# EAGLE design Dev21 (EAGLE 9.1.3)
PROJECT: This Project
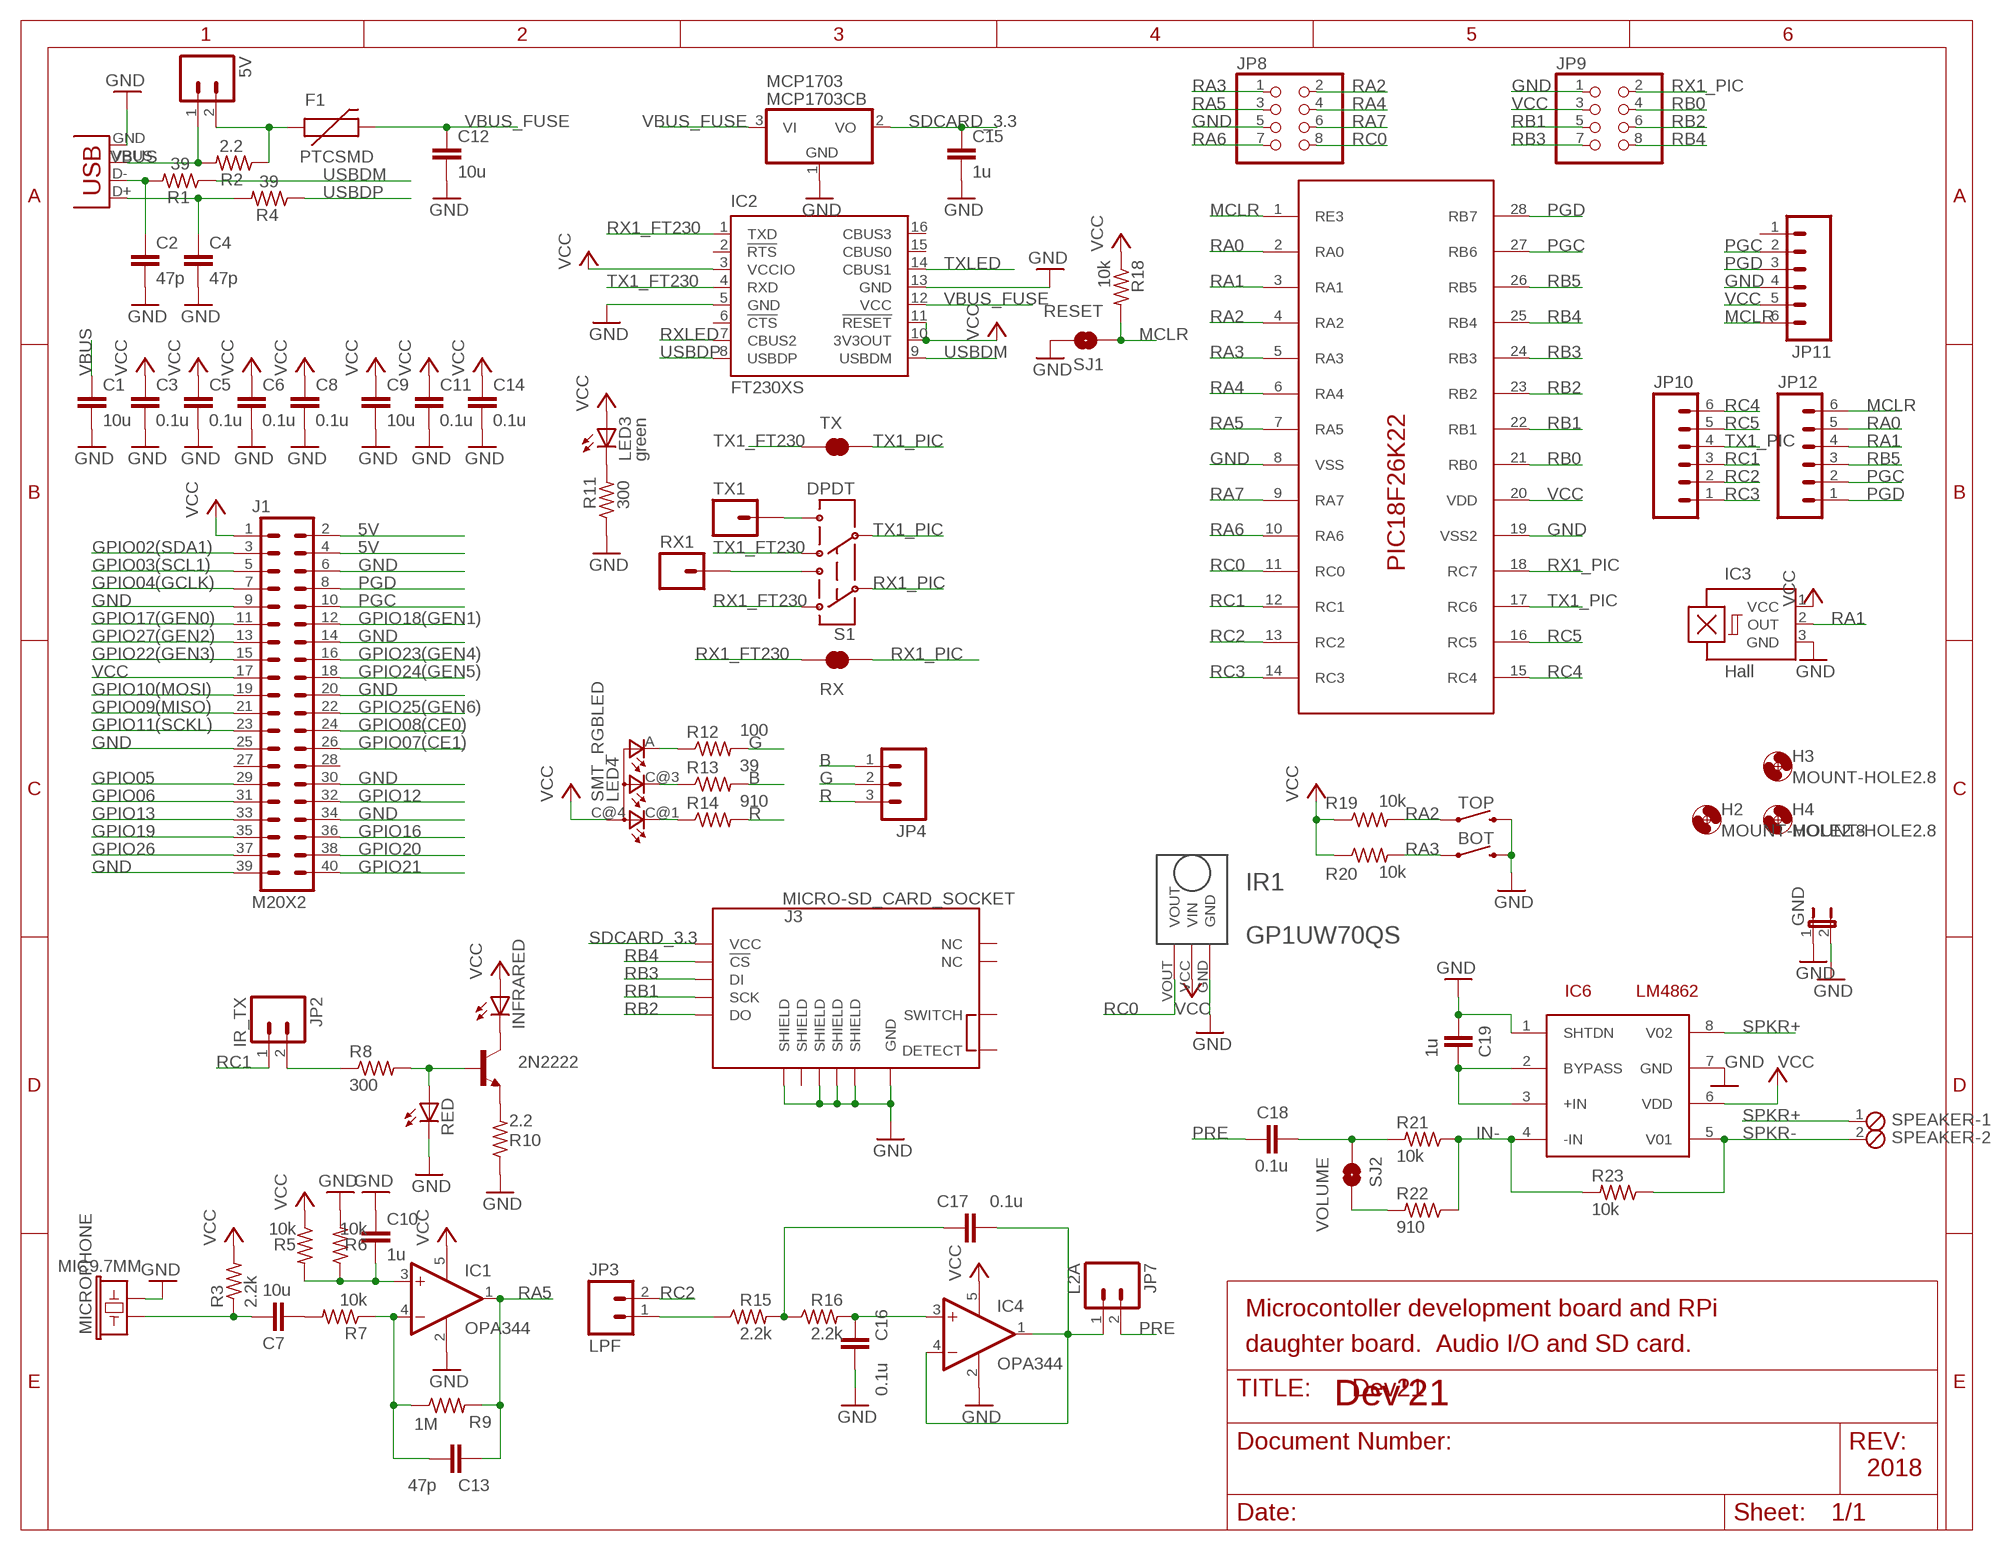
[diagram p0: schematic, sheet 1]

## Parts
2N2222  TRANSISTOR_NPNSOT23-3  [SOT23-3]
5V  M02LOCK  [1X02_LOCK]
BOT  MOMENTARY-SWITCH-SPST-SMD-5.2MM  [TACTILE_SWITCH_SMD_5.2MM]
C1  10u  C-EUC1206  [C1206]
C2  47p  C-EUC1206  [C1206]
C3  0.1u  C-EUC1206  [C1206]
C4  47p  C-EUC1206  [C1206]
C5  0.1u  C-EUC1206  [C1206]
C6  0.1u  C-EUC1206  [C1206]
C7  10u  C-EUC1206  [C1206]
C8  0.1u  C-EUC1206  [C1206]
C9  10u  C-EUC1206  [C1206]
C10  1u  C-EUC1206  [C1206]
C11  0.1u  C-EUC1206  [C1206]
C12  10u  C-EUC1206  [C1206]
C13  47p  C-EUC1206  [C1206]
C14  0.1u  C-EUC1206  [C1206]
C15  1u  C-EUC1206  [C1206]
C16  0.1u  C-EUC1206  [C1206]
C17  0.1u  C-EUC1206  [C1206]
C18  0.1u  C-EUC1206  [C1206]
C19  1u  C-EUC1206  [C1206]
F1  PTCSMD  [PTC-1206]
GND  JP1E  [JP1]
H2  MOUNT-HOLE2.8  [2,8]
H3  MOUNT-HOLE2.8  [2,8]
H4  MOUNT-HOLE2.8  [2,8]
IC1  OPA344  OPA344N-SOT23  [SOT23-5]
IC2  FT230XS  [SSOP16]
IC3  Hall  A1202LH  [SOT23-W]
IC4  OPA344  OPA344N-SOT23  [SOT23-5]
IC6  LM4862  [SO08]
INFRARED  LED1206  [LED-1206]
IR1  GP1UW70QS  [GP1UW70QS]
J1  M20X2  [2X20]
J3  MICRO-SD_CARD_SOCKET  [MICRO-SD-SOCKET]
JP2  IR_TX  M02LOCK  [1X02_LOCK]
JP3  LPF  M02LOCK  [1X02_LOCK]
JP4  M03LOCK  [1X03_LOCK]
JP7  L2A  M02LOCK  [1X02_LOCK]
JP8  PINHD-2X4  [2X04]
JP9  PINHD-2X4  [2X04]
JP10  M06LOCK  [1X06_LOCK]
JP11  M06LOCK  [1X06_LOCK]
JP12  M06LOCK  [1X06_LOCK]
LED3  green  LED1206  [LED-1206]
LED4  SMT_RGBLED  [P-LCC-4]
MCP1703  MCP1703CB  [SOT23]
MICROPHONE  MIC9.7MM  [MIC-9.7MM]
PIC18F26K22  PIC18F26J2228SSOP  [SSOP28DB]
R1  39  R-US_R1206  [R1206]
R2  2.2  R-US_R1206  [R1206]
R3  2.2k  R-US_R1206  [R1206]
R4  39  R-US_R1206  [R1206]
R5  10k  R-US_R1206  [R1206]
R6  10k  R-US_R1206  [R1206]
R7  10k  R-US_R1206  [R1206]
R8  300  R-US_R1206  [R1206]
R9  1M  R-US_R1206  [R1206]
R10  2.2  R-US_R1206  [R1206]
R11  300  R-US_R1206  [R1206]
R12  100  R-US_R1206  [R1206]
R13  39  R-US_R1206  [R1206]
R14  910  R-US_R1206  [R1206]
R15  2.2k  R-US_R1206  [R1206]
R16  2.2k  R-US_R1206  [R1206]
R18  10k  R-US_R1206  [R1206]
R19  10k  R-US_R1206  [R1206]
R20  10k  R-US_R1206  [R1206]
R21  10k  R-US_R1206  [R1206]
R22  910  R-US_R1206  [R1206]
R23  10k  R-US_R1206  [R1206]
RED  LED1206  [LED-1206]
RX  SJ_NC  JUMPER-SMT_2_NC_TRACE_NO-SILK  [SMT-JUMPER_2_NC_TRACE_NO-SILK]
RX1  M01PTH  [1X01]
S1  DPDT  SWITCH-DPDTAYZ0202  [AYZ0202]
SJ1  RESET  SOLDERJUMPERNC2  [SJ_2S-NOTRACE]
SJ2  VOLUME  SOLDERJUMPERNC2  [SJ_2S-NOTRACE]
SPEAKER  MPT2  [2POL254]
TOP  MOMENTARY-SWITCH-SPST-SMD-5.2MM  [TACTILE_SWITCH_SMD_5.2MM]
TX  SJ_NC  JUMPER-SMT_2_NC_TRACE_NO-SILK  [SMT-JUMPER_2_NC_TRACE_NO-SILK]
TX1  M01PTH  [1X01]
X1  USBSMD  [USB-MINIB]

## Nets
5V: J1.2 J1.4
B: JP4.1 R13.2
G: JP4.2 R12.2
GND: BOT.3 C1.2 C2.2 C3.2 C4.2 C5.2 C6.2 C8.2 C9.2 C10.1 C11.2 C12.2 C14.2 C15.2 C16.1 C19.2 GND.1 GND.2 IC1.2(V-) IC2.5(GND) IC2.13(GND) IC3.3(GND) IC4.2(V-) IC6.1(SHTDN) IC6.7(GND) IR1.GND J1.6 J1.9 J1.14 J1.20 J1.25 J1.30 J1.34 J1.39 J3.GND J3.SHIELD1(SHIELD) J3.SHIELD3(SHIELD) J3.SHIELD4(SHIELD) J3.SHIELD5(SHIELD) JP8.5 JP9.1 JP11.4 MCP1703.1(GND) MICROPHONE.2 PIC18F26K22.8(VSS) PIC18F26K22.19(VSS2) R6.2 R10.1 R11.1 RED.C SJ1.2 TOP.3 X1.GND
GPIO02(SDA1): J1.3
GPIO03(SCL1): J1.5
GPIO04(GCLK): J1.7
GPIO05: J1.29
GPIO06: J1.31
GPIO07(CE1): J1.26
GPIO08(CE0): J1.24
GPIO09(MISO): J1.21
GPIO10(MOSI): J1.19
GPIO11(SCKL): J1.23
GPIO12: J1.32
GPIO13: J1.33
GPIO16: J1.36
GPIO17(GEN0): J1.11
GPIO18(GEN1): J1.12
GPIO19: J1.35
GPIO20: J1.38
GPIO21: J1.40
GPIO22(GEN3): J1.15
GPIO23(GEN4): J1.16
GPIO24(GEN5): J1.18
GPIO25(GEN6): J1.22
GPIO26: J1.37
GPIO27(GEN2): J1.13
IN-: IC6.4(-IN) R21.1 R22.1 R23.2
MCLR: JP11.6 JP12.6 PIC18F26K22.1(RE3) R18.2 SJ1.1
MIC: C13.1 IC1.4(-IN) R7.1 R9.1
N$1: C16.2 IC4.3(+IN) R16.2
N$2: C17.2 R15.2 R16.1
N$3: C17.1 IC4.1(OUT) IC4.4(-IN) JP7.1
N$4: JP3.1 R15.1
N$6: C2.1 R1.2 X1.D-
N$7: C4.1 R4.2 X1.D+
N$8: C7.1 MICROPHONE.1 R3.1
N$9: C7.2 R7.2
N$10: 5V.2 F1.1 R2.1
N$11: C10.2 IC1.3(+IN) R5.2 R6.1
N$12: RX1.1 S1.3
N$13: LED4.C@1(CRED) R14.1
N$14: LED4.A(CGREEN) R12.1
N$15: 2N2222.3(C) INFRARED.C
N$16: LED3.C R11.2
N$17: 2N2222.2(E) R10.2
N$18: LED4.C@3(CBLUE) R13.1
N$19: 2N2222.1(B) R8.2 RED.A
N$20: C19.1 IC6.2(BYPASS) IC6.3(+IN)
N$22: JP2.2 R8.1
N$23: S1.6 TX1.1
N$27: C18.1 R21.2 SJ2.1
N$28: R22.2 SJ2.2
PGC: J1.10 JP11.2 JP12.2 PIC18F26K22.27(RB6)
PGD: J1.8 JP11.3 JP12.1 PIC18F26K22.28(RB7)
PRE: C18.2 JP7.2
R: JP4.3 R14.2
RA0: JP12.5 PIC18F26K22.2(RA0)
RA1: IC3.2(OUT) JP12.4 PIC18F26K22.3(RA1)
RA2: JP8.2 PIC18F26K22.4(RA2) R19.2 TOP.1
RA3: BOT.1 JP8.1 PIC18F26K22.5(RA3) R20.2
RA4: JP8.4 PIC18F26K22.6(RA4)
RA5: C13.2 IC1.1(OUT) JP8.3 PIC18F26K22.7(RA5) R9.2
RA6: JP8.7 PIC18F26K22.10(RA6)
RA7: JP8.6 PIC18F26K22.9(RA7)
RB0: JP9.4 PIC18F26K22.21(RB0)
RB1: J3.SCLK(SCK) JP9.5 PIC18F26K22.22(RB1)
RB2: J3.DO JP9.6 PIC18F26K22.23(RB2)
RB3: J3.DI JP9.7 PIC18F26K22.24(RB3)
RB4: J3.CS(!CS) JP9.8 PIC18F26K22.25(RB4)
RB5: JP12.3 PIC18F26K22.26(RB5)
RC0: IR1.VOUT JP8.8 PIC18F26K22.11(RC0)
RC1: JP2.1 JP10.3 PIC18F26K22.12(RC1)
RC2: JP3.2 JP10.2 PIC18F26K22.13(RC2)
RC3: JP10.1 PIC18F26K22.14(RC3)
RC4: JP10.6 PIC18F26K22.15(RC4)
RC5: JP10.5 PIC18F26K22.16(RC5)
RX1_FT230: IC2.1(TXD) RX.1 S1.1
RX1_PIC: JP9.2 PIC18F26K22.18(RC7) RX.2 S1.2
RXLED: IC2.7(CBUS2)
SDCARD_3.3: C15.1 J3.VCC MCP1703.2(VO)
SPKR+: IC6.8(V02) SPEAKER.1
SPKR-: IC6.5(V01) R23.1 SPEAKER.2
TX1_FT230: IC2.4(RXD) S1.4 TX.1
TX1_PIC: JP10.4 PIC18F26K22.17(RC6) S1.5 TX.2
TXLED: IC2.14(CBUS1)
USBDM: IC2.9(USBDM) R1.1
USBDP: IC2.8(USBDP) R4.1
VBUS: 5V.1 C1.1 R2.2 X1.VBUS
VBUS_FUSE: C12.1 F1.2 IC2.12(VCC) MCP1703.3(VI)
VCC: C3.1 C5.1 C6.1 C8.1 C9.1 C11.1 C14.1 IC1.5(V+) IC2.3(VCCIO) IC2.10(3V3OUT) IC2.11(!RESET) IC3.1(VCC) IC4.5(V+) IC6.6(VDD) INFRARED.A IR1.VCC(VIN) J1.1 J1.17 JP9.3 JP11.5 LED3.A LED4.C@4(A) PIC18F26K22.20(VDD) R3.2 R5.1 R18.1 R19.1 R20.1
Unconnected: IC2.2(!RTS) IC2.6(!CTS) IC2.15(CBUS0) IC2.16(CBUS3) J1.27 J1.28 J3.DETECT J3.NC1(NC) J3.NC2(NC) J3.SHIELD2(SHIELD) J3.SWITCH JP11.1

## Notes on the sheet
- Microcontoller development board and RPi
- daughter board.  Audio I/O and SD card.
- Dev'21
- 2018

## Library data of the parts
2N2222 = SparkFun-DiscreteSemi:TRANSISTOR_NPN: Generic NPN BJT MMBT2222A - TRANS-08049 (SOT-23, 1A 40V) MPSA42 - TRANS-09116 (SOT-23, 500mA 300V) MMBT5088LT1G - TRANS-11160 (SOT-23, 50 mA 30V) BC547 - COM-08928 <http://www.sparkfun.com/products/8928> (TO-92 45V 100mA) (1.Collector 2.Base 3.Emitter) 2N3904 - COM-00521 <http://www.sparkfun.com/products/521> (TO-92 40V 200mA) (1.Emitter 2.Base 3.Collector) P2N2222A - COM-12852 <http://www.sparkfun.com/products/12852> (TO-92 40V 600mA) (1.Collector 2.Base 3.Emitter); PROD_ID: TRANS-08049
5V JP2 JP3 JP7 = SparkFun:M02: Header 2 Standard 2-pin 0.1" header. Use with straight break away headers (SKU : PRT-00116), right angle break away headers (PRT-00553), swiss pins (PRT-00743), machine pins (PRT-00117), and female headers (PRT-00115). Molex polarized connector foot print use with SKU : PRT-08233 with associated crimp pins and housings.
BOT TOP = SparkFun-Switches:MOMENTARY-SWITCH-SPST: Momentary Switch (Pushbutton) - SPST Normally-open (NO) SPST momentary switches (buttons, pushbuttons). Variants PTH-12MM - 12mm square, through-hole Momentary Pushbutton Switch - 12mm Square <https://www.sparkfun.com/products/9190> (COM-09190) PTH-6.0MM, PTH-6.0MM-KIT - 6.0mm square, through-hole Mini Pushbutton Switch <https://www.sparkfun.com/products/97> (COM-00097) KIT package intended for soldering kit's - only one side of pads' copper is exposed. PTH-RIGHT-ANGLE-KIT - Right-angle, through-hole Right Angle Tactile Button <https://www.sparkfun.com/products/10791> - Used on SparkFun BigTime Watch Kit <https://www.sparkfun.com/products/11734> SMD-12MM - 12mm square, surface-mount Tactile Button - SMD (12mm) <https://www.sparkfun.com/products/12993> (COM-12993) Used on SparkFun PicoBoard <https://www.sparkfun.com/products/11888> SMD-4.5MM - 4.5mm Square Trackball Switch Used on SparkFun Blackberry Trackballer Breakout <https://www.sparkfun.com/products/13169> SMD-4.6MMX2.8MM - 4.60mm x 2.80mm, surface mount Used on SparkFun SAMD21 Mini Breakout <https://www.sparkfun.com/products/13664> SMD-5.2MM, SMD-5.2-REDUNDANT - 5.2mm square, surface-mount Mini Pushbutton Switch - SMD <https://www.sparkfun.com/products/8720> (COM-08720) Used on Arduino Pro Mini <https://www.sparkfun.com/products/11114> REDUNDANT package connects both switch circuits together SMD-6.0X3.5MM - 6.0 x 3.5mm, surface mount Momentary Reset Switch SMD <https://www.sparkfun.com/products/8229> (COM-08229) SMD-6.2MM-TALL - 6.2mm square, surface mount Tactile Button - SMD (6mm) <https://www.sparkfun.com/products/12992> Used on SparkFun Digital Sandbox <https://www.sparkfun.com/products/12651> SMD-RIGHT-ANGLE - Right-angle, surface mount Used on SparkFun Block for Intel® Edison - Arduino <https://www.sparkfun.com/products/13036>; PROD_ID: SWCH-08247; SF_SKU: COM-08720
C1-C19 = rcl:C-EU: CAPACITOR, European symbol
F1 = SparkFun:PTC: Resettable Fuse PTC Resettable Fuse. Spark Fun Electronics SKU : COM-08357
GND = jumper:JP1E: JUMPER
H2-H4 = holes:MOUNT-HOLE: MOUNTING HOLE with drill center marker
IC1 IC4 = linear:OPA*-SOT23: Single Operational Amplifier Low Power, Single-Supply, Rail-To-Rail Operational Amplifier Source: http://focus.ti.com/lit/ds/symlink/opa2345.pdf
IC2 = ftdichip:FT230X: USB to BASIC UART IC Auto generated by make-symbol-device-package-bsdl.ulp Rev. 43 Source: Data sheet <http://www.ftdichip.com/Support/Documents/DataSheets/ICs/DS_FT230X.pdf>
IC3 = allegro:A12*?: Hall-effect bipolar switch Source: http://www.allegromicro.com/en/Products/Part_Numbers/1202/1202.pdf; OC_FARNELL: unknown; OC_NEWARK: unknown
IC6 = coulston:LM4862
INFRARED LED3 RED = SparkFun:LED: LEDs Standard schematic elements and footprints for 5mm, 3mm, 1206, and 0603 sized LEDs. 5mm - Spark Fun Electronics SKU : COM-00529 (and others)
IR1 = coulston:GP1UW70QS
J1 = SparkFun-Connectors:M20X2: 0.1" spaced headers
J3 = coulston:MICRO-SD_CARD_SOCKET: microSD Socket for Transflash Push-push type µSD socket. tDoc line correctly indicate media card edge positions when locked. NOTE:Switch and Detect are N.O. SD card presence indicator.; DIGIKEY: WM12834CT-ND
JP4 = SparkFun:M03: Header 3 Standard 3-pin 0.1" header. Use with straight break away headers (SKU : PRT-00116), right angle break away headers (PRT-00553), swiss pins (PRT-00743), machine pins (PRT-00117), and female headers (PRT-00115). Molex polarized connector foot print use with SKU : PRT-08232 with associated crimp pins and housings.
JP8 JP9 = pinhead:PINHD-2X4: PIN HEADER
JP10-JP12 = SparkFun:M06: Header 6 Standard 6-pin 0.1" header. Use with straight break away headers (SKU : PRT-00116), right angle break away headers (PRT-00553), swiss pins (PRT-00743), machine pins (PRT-00117), and female headers (PRT-00115). Molex polarized connector foot print use with SKU : PRT-08094 with associated crimp pins and housings. NOTES ON THE VARIANTS LOCK and LOCK_LONGPADS... This footprint was designed to help hold the alignment of a through-hole component (i.e. 6-pin header) while soldering it into place. You may notice that each hole has been shifted either up or down by 0.005 of an inch from it's more standard position (which is a perfectly straight line). This slight alteration caused the pins (the squares in the middle) to touch the edges of the holes. Because they are alternating, it causes a "brace" to hold the component in place. 0.005 has proven to be the perfect amount of "off-center" position when using our standard breakaway headers. Although looks a little odd when you look at the bare footprint, once you have a header in there, the alteration is very hard to notice. Also, if you push a header all the way into place, it is covered up entirely on the bottom side. This idea of altering the position of holes to aid alignment will be further integrated into the Sparkfun Library for other footprints. It can help hold any component with 3 or more connection pins.
LED4 = coulston:SMT_RGBLED: Chip LED RGB Source: http://document.sharpsma.com/files/GM1WA55311A_SS.pdf
MCP1703 = linear:MCP1703: 250 mA, 16V, Low Quiescent Current LDO Regulator Source: http://ww1.microchip.com/downloads/en/DeviceDoc/22049b.pdf
MICROPHONE = SparkFun-Sensors:MIC: Omni-directional electret microphone. 9.7mm standard diameter.; PROD_ID: COMP-08856
PIC18F26K22 = coulston:PIC18F26J22
R1-R16 R18-R23 = rcl:R-US_: RESISTOR, American symbol
RX TX = SparkFun-Jumpers:JUMPER-SMT_2_NC_TRACE: Normally closed trace jumper This jumper has a trace between two pads so it's normally closed (NC). Use a razor knife to open the connection. For best results follow the IPC guidelines for cutting traces: Cutout at least 0.063 mm (0.005 in). Remove all loose material to clean up the cut area. Seal the cut with an approved epoxy. Reapply solder to reclose the connection.
RX1 TX1 = SparkFun-Connectors:M01: Header 1 Standard 1-pin 0.1" header. Use with straight break away headers (SKU : PRT-00116), right angle break away headers (PRT-00553), swiss pins (PRT-00743), machine pins (PRT-00117), and female headers (PRT-00115). SMTSO-256-ET is a "flush mount" nut for a 4-40 screw. The older package used to be too tight, and did not allow it to sit properly thru the drill hit. The latest (0.165DIA) fits nice and snug.
S1 = SparkFun-Electromechanical:SWITCH-DPDT: DPDT Version of the COM-00597; PROD_ID: SWCH-08179
SJ1 SJ2 = SparkFun:SOLDERJUMPER: Solder Jumper Standard SMD solder jumper. Used to automate production. Two varients : Normally Open and Normally Closed are the same, but have different paste layers. NC will have a large amount of paste and should jumper during reflow.
SPEAKER = dodecahedron:MPT2: PHOENIX CONNECTOR
X1 = SparkFun:USB: USB Connectors USB-B-PTH is fully proven SKU : PRT-00139 USB-miniB is fully proven SKU : PRT-00587 USB-A-PCB is untested. USB-A-H is throughly reviewed, but untested. Spark Fun Electronics SKU : PRT-00437 USB-B-SMT is throughly reviewed, but untested. Needs silkscreen touching up. USB-A-S has not been used/tested USB-MB-H has not been used/tested

## Board
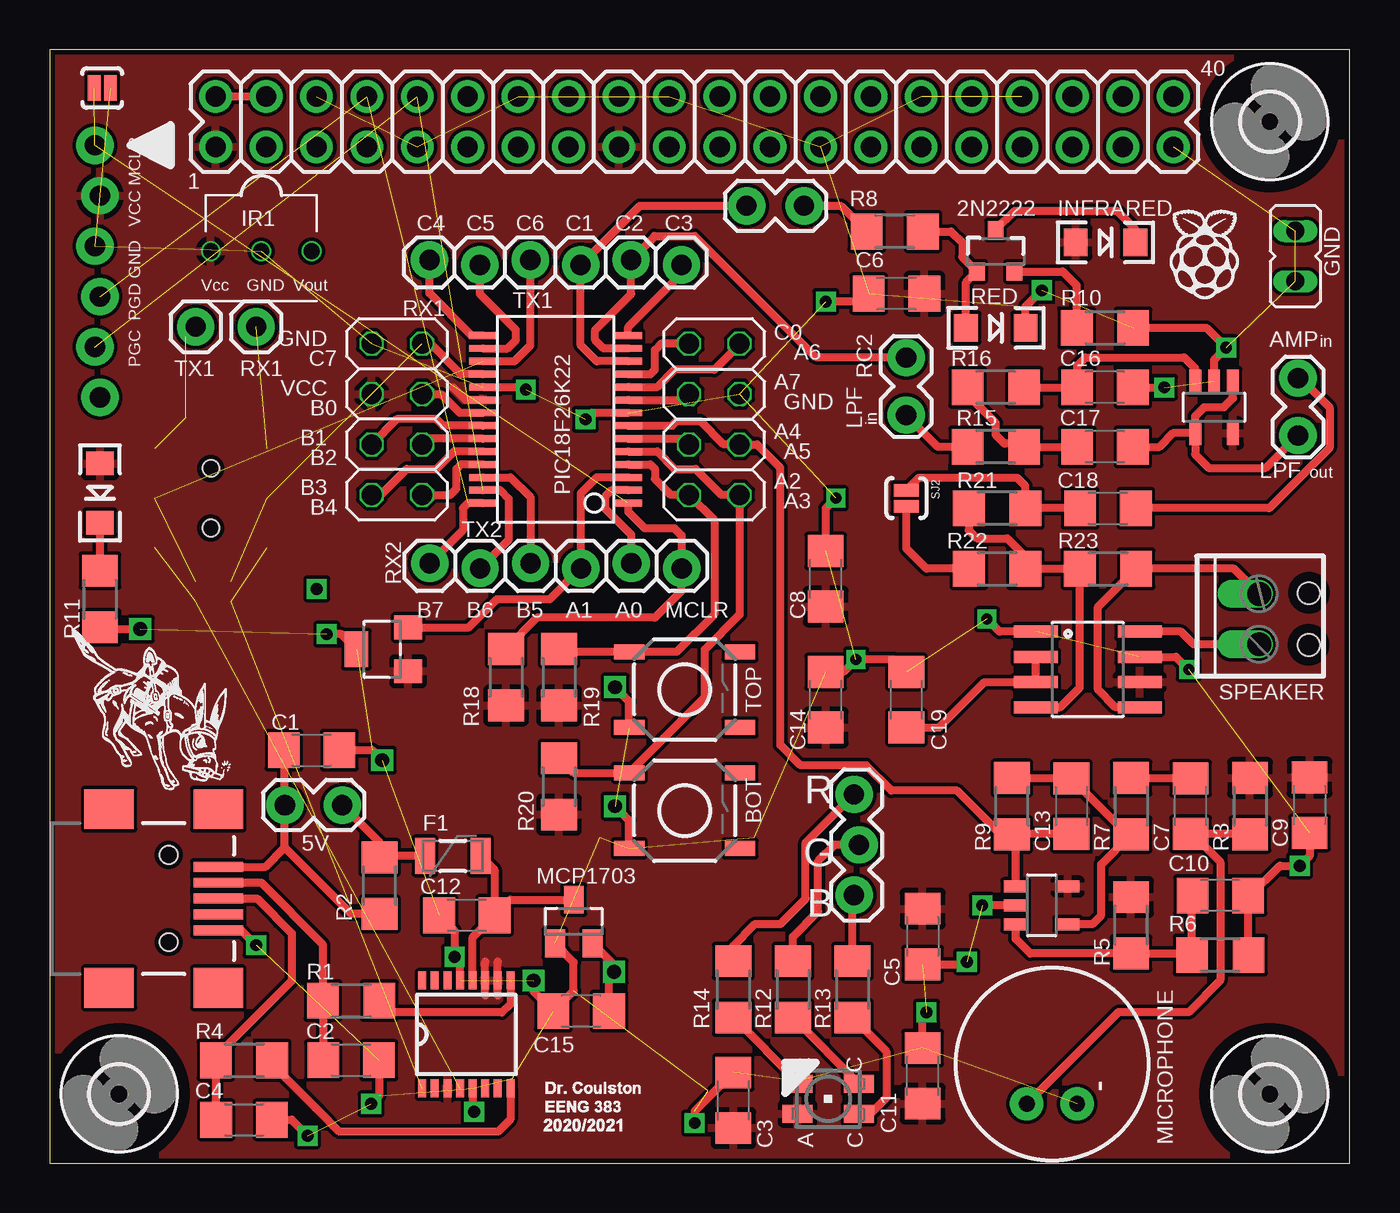
[diagram p1: board, top side]
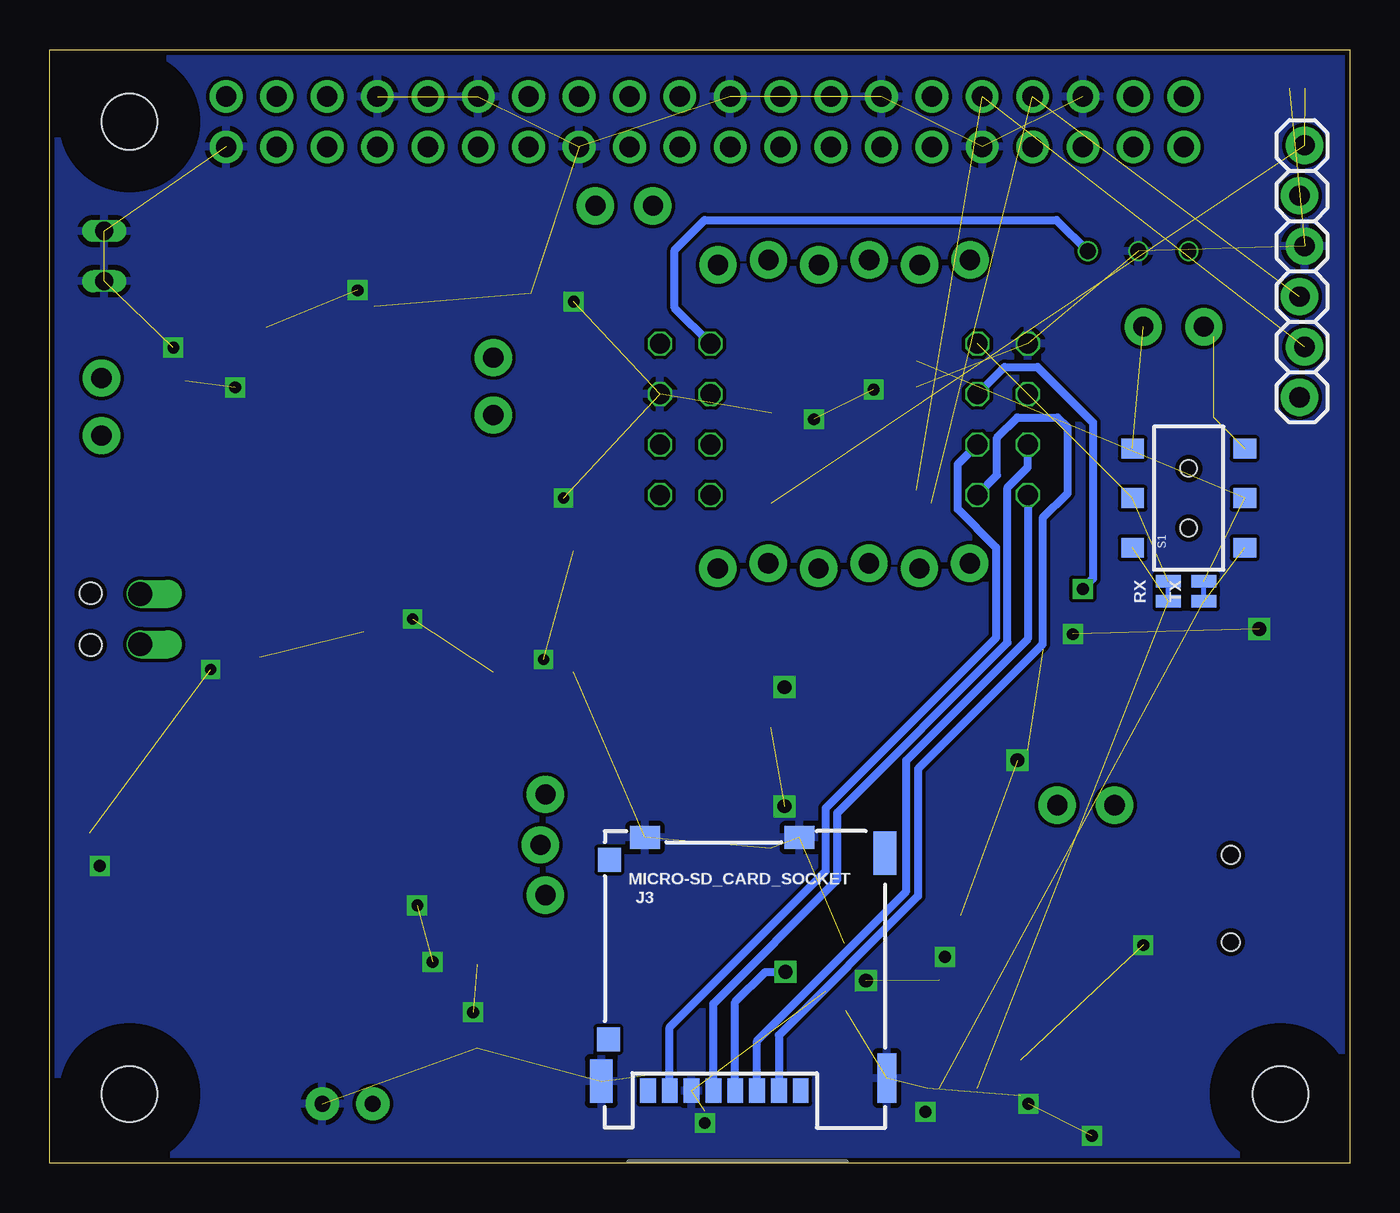
[diagram p2: board, bottom side, seen from below]

Size 65.53 x 56.13 mm. Coordinates in mm from the lower left corner, seen from the top.
Outline: 0,0 65.53,0 65.53,56.13 0,56.13 0,0
Copper layers (1*16): Top 0.0356mm / dielectric 1.5011mm / Bottom 0.0356mm
Design rules "SilverCircuits": minimum track width 7mil, minimum drill 10mil, track to track 7mil, track to pad 7mil, pad to pad 7mil, via to via 7mil, smd to smd 0mil, copper to edge 10mil, drill to drill 10mil, minimum pad ring 4mil, minimum via ring 8mil, stop-mask expansion 4mil, vias tented up to drill 0mil, thermal gap 10mil

### Footprints (pad centres in the part's own frame; a part is rotated, then mirrored left to right if it is on the bottom)
SOT23-3 = smd 0.8 x 0.9: 1 -0.95,-1; 2 0.95,-1; 3 0,1.1
1X02_LOCK = drill 1.016 pad 1.88: 1 -0.178,0; 2 2.718,0
TACTILE_SWITCH_SMD_5.2MM = smd 1.524 x 0.762: 1 -2.794,1.905; 2 2.794,1.905; 3 -2.794,-1.905; 4 2.794,-1.905
C1206 = smd 1.6 x 1.8: 1 -1.4,0; 2 1.4,0
PTC-1206 = smd 1 x 1.8: 1 -1.4,0; 2 1.4,0
JP1 = drill 0.914 long: 1 0,-1.27; 2 0,1.27
2,8 = hole 2.8: 0,0
SOT23-5 = smd 0.6 x 1.2: 1 -0.95,-1.306; 2 0,-1.306; 3 0.95,-1.306; 4 0.95,1.306; 5 -0.95,1.306
SSOP16 = smd 0.914 x 0.406: 1 -2.718,2.223; 2 -2.718,1.587; 3 -2.718,0.953; 4 -2.718,0.318; 5 -2.718,-0.318; 6 -2.718,-0.953; 7 -2.718,-1.587; 8 -2.718,-2.223; 9 2.718,-2.223; 10 2.718,-1.587; 11 2.718,-0.953; 12 2.718,-0.318; 13 2.718,0.318; 14 2.718,0.953; 15 2.718,1.587; 16 2.718,2.223
SOT23-W = smd 1.2 x 1.4: 1 -1.1,-1.3; 2 1.1,-1.3 | smd 1.8 x 1.2: 3 0,1.3
SO08 = smd 0.61 x 2.21: 1 -1.905,-2.616; 2 -0.635,-2.616; 3 0.635,-2.616; 4 1.905,-2.616; 5 1.905,2.616; 6 0.635,2.616; 7 -0.635,2.616; 8 -1.905,2.616
LED-1206 = smd 1.2 x 1.4: A -1.5,0; C 1.5,0
GP1UW70QS = drill 0.8: GND 0,2.54; VCC -2.54,2.54; VOUT 2.54,2.54
2X20 = drill 1.016 pad 1.651: 1 -24.13,-1.27; 2 -24.13,1.27; 3 -21.59,-1.27; 4 -21.59,1.27; 5 -19.05,-1.27; 6 -19.05,1.27; 7 -16.51,-1.27; 8 -16.51,1.27; 9 -13.97,-1.27; 10 -13.97,1.27; 11 -11.43,-1.27; 12 -11.43,1.27; 13 -8.89,-1.27; 14 -8.89,1.27; 15 -6.35,-1.27; 16 -6.35,1.27; 17 -3.81,-1.27; 18 -3.81,1.27; 19 -1.27,-1.27; 20 -1.27,1.27; 21 1.27,-1.27; 22 1.27,1.27; 23 3.81,-1.27; 24 3.81,1.27; 25 6.35,-1.27; 26 6.35,1.27; 27 8.89,-1.27; 28 8.89,1.27; 29 11.43,-1.27; 30 11.43,1.27; 31 13.97,-1.27; 32 13.97,1.27; 33 16.51,-1.27; 34 16.51,1.27; 35 19.05,-1.27; 36 19.05,1.27; 37 21.59,-1.27; 38 21.59,1.27; 39 24.13,-1.27; 40 24.13,1.27
MICRO-SD-SOCKET = smd 0.8 x 1.24: CS 5.92,-0.62; DI 7.02,-0.62; DO 11.42,-0.62; GND 10.32,-0.62; NC1 4.82,-0.62; NC2 12.52,-0.62; SCLK 9.22,-0.62; VCC 8.12,-0.62 | smd 1.16 x 1.2: DETECT 14.46,-12.25; SWITCH 14.505,-3.205 | smd 0.95 x 2.5: SHIELD1 0.475,-1.25 | smd 1.15 x 2.2: SHIELD2 0.575,-12.58; SHIELD5 14.865,-1.1 | smd 1.5 x 1.15: SHIELD3 4.88,-13.375; SHIELD4 12.66,-13.375
1X03_LOCK = drill 1.016 pad 1.88: 1 0,0.127; 2 2.54,-0.127; 3 5.08,0.127
2X04 = drill 1.016 octagon: 1 -3.81,-1.27; 2 -3.81,1.27; 3 -1.27,-1.27; 4 -1.27,1.27; 5 1.27,-1.27; 6 1.27,1.27; 7 3.81,-1.27; 8 3.81,1.27
1X06_LOCK = drill 1.016 pad 1.88: 1 0,0; 2 2.54,-0.254; 3 5.08,0; 4 7.62,-0.254; 5 10.16,0; 6 12.7,-0.254
P-LCC-4 = smd 0.9 x 1.5: A -0.75,1.55; C@1 -0.75,-1.55; C@3 0.75,1.55; C@4 0.75,-1.55
SOT23 = smd 1 x 1.4: 1 -0.95,-1.1; 2 0.95,-1.1; 3 0,1.1
MIC-9.7MM = drill 0.8 pad 1.676: 1 -2,1.27; 2 -2,-1.27
SSOP28DB = smd 0.348 x 1.397: 1 -4.225,-3.656; 2 -3.575,-3.656; 3 -2.925,-3.656; 4 -2.275,-3.656; 5 -1.625,-3.656; 6 -0.975,-3.656; 7 -0.325,-3.656; 8 0.325,-3.656; 9 0.975,-3.656; 10 1.625,-3.656; 11 2.275,-3.656; 12 2.925,-3.656; 13 3.575,-3.656; 14 4.225,-3.656; 15 4.225,3.656; 16 3.575,3.656; 17 2.925,3.656; 18 2.275,3.656; 19 1.625,3.656; 20 0.975,3.656; 21 0.325,3.656; 22 -0.325,3.656; 23 -0.975,3.656; 24 -1.625,3.656; 25 -2.275,3.656; 26 -2.925,3.656; 27 -3.575,3.656; 28 -4.225,3.656
R1206 = smd 1.6 x 1.803: 1 -1.422,0; 2 1.422,0
SMT-JUMPER_2_NC_TRACE_NO-SILK = smd 0.635 x 1.27: 1 -0.508,0; 2 0.508,0
1X01 = drill 1.016 pad 1.88: 1 0,0
AYZ0202 = smd 1 x 1.15: 1 -2.5,2.825; 2 0,2.825; 3 2.5,2.825; 4 -2.5,-2.825; 5 0,-2.825; 6 2.5,-2.825 | hole 0.85: 1.5,0; -1.5,0
SJ_2S-NOTRACE = smd 0.635 x 1.27: 1 -0.401,0; 2 0.413,0
2POL254 = drill 1.2 offset: 1 -1.27,0; 2 1.27,0 | hole 1.1: -1.3,-2.5; 1.3,-2.5
USB-MINIB = smd 2.5 x 0.5: D+ 2.5,0; D- 2.5,0.8; GND 2.5,-1.6; ID 2.5,-0.8; VBUS 2.5,1.6 | smd 2.5 x 2: MTN1 -3,4.5; MTN2 2.5,4.5; MTN3 -3,-4.5; MTN4 2.5,-4.5 | hole 0.9: 0,2.2; 0,-2.2

### Placement (x,y rotation side)
2N2222  47.68,45.95 0 top
5V  12.03,18.06 0 top
BOT  32,17.78 0 top
C1  13.21,20.83 0 top
C2  15.2,5.2 0 top
C3  34.46,3.18 90 top
C4  9.8,2.2 0 top
C5  44,11.44 270 top
C6  42.68,43.84 180 top
C7  57.5,18 90 top
C8  39.12,29.46 90 top
C9  63.5,18.05 270 top
C10  59,13.5 180 top
C11  44,4.41 90 top
C12  21.02,12.5 180 top
C13  51.5,18 270 top
C14  39.12,23.37 90 top
C15  26.79,7.68 180 top
C16  53.19,39.11 180 top
C17  53.19,36.11 180 top
C18  53.34,33.02 0 top
C19  43.18,23.37 90 top
F1  20.32,15.5 0 top
GND  62.78,45.73 0 top
H2  61.5,3.5 0 top
H3  61.5,52.5 0 top
H4  3.5,3.5 0 top
IC1  50,13 270 top
IC2  21,6.5 90 top
IC3  16.76,25.91 90 top
IC4  58.69,38.11 180 top
IC6  52.32,24.89 270 top
INFRARED  53.21,46.42 0 top
IR1  10.67,43.43 0 top
J1  32.5,52.5 0 top
J3  22.86,3.05 180 bottom
JP2  35.31,48.26 0 top
JP3  43.17,37.89 90 top
JP4  40.67,13.52 90 top
JP7  62.92,36.86 90 top
JP8  33.5,37.5 90 top
JP9  17.5,37.5 270 top
JP10  31.84,45.28 180 top
JP11  2.54,38.61 90 bottom
JP12  19.16,30.24 0 top
LED3  2.54,33.78 270 top
LED4  39.24,3.25 270 top
MCP1703  26.42,12.19 0 top
MICROPHONE  50.52,5 90 top
PIC18F26K22  25.5,37.5 90 top
R1  15.2,8.2 180 top
R2  16.64,14 270 top
R3  60.5,18 90 top
R4  9.8,5.2 180 top
R5  54.5,12 270 top
R6  59,10.5 0 top
R7  54.5,18 90 top
R8  42.6,46.96 0 top
R9  48.5,18 270 top
R10  53.19,42.11 180 top
R11  2.54,28.45 90 top
R12  37.46,8.77 90 top
R13  40.46,8.77 90 top
R14  34.46,8.77 90 top
R15  47.69,36.11 0 top
R16  47.69,39.11 0 top
R18  23,24.5 90 top
R19  25.68,24.5 90 top
R20  25.68,19 90 top
R21  47.75,33.02 0 top
R22  47.75,29.97 180 top
R23  53.34,29.97 180 top
RED  47.69,42.11 0 top
RX  9.14,28.83 90 bottom
RX1  10.41,42.16 0 top
S1  8.13,33.53 90 bottom
SJ1  2.65,54.2 0 top
SJ2  43.18,33.53 270 top
SPEAKER  60.96,27.43 90 top
TOP  32,23.88 0 top
TX  7.37,28.83 90 bottom
TX1  7.37,42.16 0 top
X1  6,13.35 0 top

### Tracks (layer width: path | path; a pad name or v marks a point on that pad's centre or on a via)
5V
  Top 0.406: J1.4 J1.2
B
  Top 0.406: R13.2 40.46,13.43 JP4.1
G
  Top 0.406: JP4.2 39.55,16.05 38.73,15.24 38.73,12.7 37.46,11.43 R12.2
GND  (via drill 0.55, 0.6, 0.6 pad 1, 0.7)  (46 unrouted)
  Top 0.406: PIC18F26K22.19 23.88,39.12 v24,39 | PIC18F26K22.8 27.32,37.83 v27,37.5 | C16.1 v56.19,39.11 | IC4.2 58.69,40.51 v59.29,41.11 58.29,42.11 R10.1 | IC1.2 v47,13 | R6.2 60.42,13.48 C10.1 60.5,13.5 62,15 v63,15 63.5,15.5 C9.2 | RED.C 49.19,43.19 v50,44 | IC2.5 21.32,2.68 v21.4,2.6 | IC2.13 20.68,10.12 v20.4,10.4 20.4,11.72 C12.2 | C2.2 16.6,3.4 v16.2,3 | C4.2 12.2,2.2 v13,1.4 | X1.GND 9.65,11.75 v10.4,11 | C6.2 40.88,43.43 v39.12,43.43 | IC3.3 14.7,26.67 v13.97,26.67 | TOP.3 29.21,23.29 v28.5,24 | BOT.3 29.21,17.29 v28.5,18 | C8.2 39.12,33.02 v39.62,33.53 | C14.2 40.01,24.77 v40.64,25.4 42.55,25.4 C19.2 | IC6.1 47.88,26.8 v47.24,27.43 | IC6.7 56.77,25.53 v57.4,24.89 | C5.2 46.1,10.04 v46.23,10.16 | C11.2 44,7.42 v44.2,7.62 | C3.2 32.51,2.63 v32.51,2.03 | MCP1703.1 26.42,10.14 26.42,8.7 C15.2 24.39,8.68 v24.39,9.21 | C1.2 16.26,20.83 v16.76,20.32 | R11.1 2.64,26.92 v4.57,26.92
  pour Bottom: 0,0 65.53,0 65.53,56.13 0,56.13
IN-
  Top 0.406: IC6.4 50.93,22.99 51.92,23.98 R23.2 R22.1 49.17,30.58 48.26,31.5 46.74,31.5 46.33,31.9 R21.1
MCLR  (2 unrouted)
  Top 0.406: PIC18F26K22.1 29.16,32.84 30,32 31.5,32 31.85,31.65 JP12.6 31.85,28.85 30.5,27.5 24.58,27.5 R18.2
MIC
  Top 0.406: IC1.4 52.55,12.05 53,12.5 53,15.08 R7.1 54.32,16.58 C13.1 51.48,19.42 R9.1
N$1
  Top 0.406: R16.2 C16.2 51.79,40.21 52.19,40.61 57.19,40.61 57.74,40.06 IC4.3
N$2
  Top 0.406: C17.2 R15.2 49.11,36.27 48.13,36.27 47.69,36.71 47.69,37.31 46.69,38.31 46.69,38.69 R16.1
N$3
  Top 0.406: IC4.1 59.64,38.56 59.19,38.11 58.19,38.11 57.74,37.66 IC4.4 | C17.1 55.92,36.11 56.61,36.8 IC4.4 | JP7.1 61.29,35.05 58.42,35.05 57.74,35.73 IC4.4
N$4
  Top 0.406: R15.1 44.77,36.11 JP3.1
N$6
  Top 0.406: C2.1 13.8,8.18 R1.2 13.78,11.02 10.65,14.15 X1.D-
N$7
  Top 0.406: C4.1 8.4,5.18 R4.2 8.38,5.38 12.2,9.2 12.2,11.6 10.45,13.35 X1.D+
N$8
  Top 0.406: R3.1 60.48,16.6 C7.1 57.6,16.6 59,15.2 59,9.22 57.4,7.62 53.87,7.62 MICROPHONE.1
N$9
  Top 0.406: C7.2 54.52,19.4 R7.2
N$10
  Top 0.406: 5V.2 16.64,16.17 R2.1 16.71,15.5 F1.1
N$11
  Top 0.406: IC1.3 48.69,11.31 49.42,10.58 R5.2 57.5,10.58 R6.1 57.58,13.48 C10.2
N$12  (1 unrouted)
N$13
  Top 0.406: R14.1 37.69,4.12 LED4.C@1
N$14
  Top 0.406: R12.1 40.79,4.02 LED4.A
N$15
  Top 0.406: INFRARED.C 54.71,47.09 53.8,48 48.63,48 2N2222.3
N$16
  Top 0.406: R11.2 LED3.C
N$17
  Top 0.406: 2N2222.2 51.06,44.95 51.77,44.25 R10.2
N$18
  Top 0.406: R13.1 42.16,5.64 42.16,3.3 41.37,2.5 LED4.C@3
N$19
  Top 0.406: R8.2 45.44,46.97 46,46.4 46,45.67 2N2222.1 46.19,44.41 RED.A
N$20
  Top 0.406: IC6.2 IC6.3 47.12,24.26 44.83,21.97 C19.1
N$22
  Top 0.406: JP2.2 39.88,48.26 R8.1
N$23  (2 unrouted)
  Bottom 0.406: TX1.1 6.86,41.66
N$27
  Top 0.406: C18.1 R21.2 49.17,34.14 48.77,34.54 43.8,34.54 SJ2.1
N$28
  Top 0.406: SJ2.2 43.18,30.99 44.2,29.97 R22.2
PGC  (2 unrouted)
  Top 0.406: JP12.2 23.15,31.45 23.15,33.49 22.72,33.92 PIC18F26K22.27
PGD  (2 unrouted)
  Top 0.406: JP12.1 20.83,31.91 20.83,33.02 21.08,33.27 PIC18F26K22.28
PRE
  Top 0.406: JP7.2 63.04,39.58 64.52,38.1 64.52,36.07 61.47,33.02 C18.2
R
  Top 0.406: R14.2 34.46,10.96 35.56,12.06 36.83,12.06 38.1,13.34 38.1,16.15 JP4.3
RA0
  Top 0.406: PIC18F26K22.2 28.32,33.92 28,33.6 28,33 29.31,31.69 JP12.5
RA1
  Top 0.406: PIC18F26K22.3 27.57,34.58 26.77,33.77 JP12.4 | JP12.4 | IC3.2 21.12,27.01 22.55,28.44 25.21,28.44 JP12.4
RA2
  Top 0.406: PIC18F26K22.4 30.27,35.23 30.5,35 30.5,34.5 31.31,33.69 JP8.2 33.5,32.42 33.5,27.68 31.61,25.78 TOP.1 25.82,25.78 R19.2
RA3
  Top 0.406: PIC18F26K22.5 30.62,35.88 31.5,35 32.56,35 33.87,33.69 JP8.1 34.77,27.66 33.02,25.91 33.02,23.5 BOT.1 26.41,19.68 R20.2
RA4
  Top 0.406: PIC18F26K22.6 31.93,36.52 JP8.4
RA5
  Top 0.406: PIC18F26K22.7 31.38,37.17 31.6,37.4 32.8,37.4 33.97,36.23 JP8.3 35.65,36.23 36.83,35.05 36.83,21.08 37.85,20.07 41.15,20.07 42.42,18.8 45.72,18.8 47,17.52 47,17.5 48,16.5 48.42,16.5 R9.2 | C13.2 48.52,16.6 R9.2 | IC1.1 48.69,16.38 R9.2
RA6
  Top 0.406: PIC18F26K22.10 30.62,39.12 31.5,40 33.5,40 34.77,41.27 JP8.7
RA7
  Top 0.406: PIC18F26K22.9 31.93,38.48 JP8.6
RB0  (via drill 0.6 pad 1)
  Top 0.406: PIC18F26K22.21 20.68,37.83 19.73,38.77 JP9.4
  Bottom 0.406: v13.46,28.96 12.95,29.46 12.95,37.34 15.75,40.13 17.41,40.13 JP9.4
RB1
  Top 0.406: PIC18F26K22.22 19.82,37.17 19.5,37.5 17.5,37.5 JP9.5
  Bottom 0.406: JP9.5 16.23,35.09 17.25,34.07 17.25,26.24 25.83,17.66 25.83,14.3 32.08,8.05 J3.SCLK
RB2
  Top 0.406: PIC18F26K22.23 19.07,36.52 JP9.6
  Bottom 0.406: JP9.6 19.76,35.24 19.76,32.97 17.84,31.04 17.84,26.49 26.42,17.91 26.42,14.73 34.28,6.87 J3.DO
RB3
  Top 0.406: PIC18F26K22.24 20.38,35.88 19.5,35 18,35 16.69,33.69 JP9.7
  Bottom 0.406: JP9.7 16.23,26.44 22.35,20.32 22.35,13.72 29.88,6.19 J3.DI
RB4
  Top 0.406: PIC18F26K22.25 20.73,35.23 20.5,35 20.5,34 20.19,33.69 JP9.8
  Bottom 0.406: JP9.8 17.78,34.68 17.78,36.58 16.76,37.59 14.73,37.59 14.22,37.08 14.22,33.78 15.49,32.51 15.49,26.16 21.77,19.89 21.77,13.47 28.78,6.46 J3.CS
RB5
  Top 0.406: PIC18F26K22.26 23.23,34.58 24.23,33.57 JP12.3
RC0
  Top 0.406: JP8.8 30.81,41.31 30.5,41 30.5,40 30.27,39.77 PIC18F26K22.11
  Bottom 0.406: JP8.8 34.04,43.12 34.04,46.04 32.52,47.55 14.78,47.55 IR1.VOUT
RC1
  Top 0.406: PIC18F26K22.12 27.57,40.42 26.77,41.23 JP10.3 29.75,48.26 JP2.1
RC2
  Top 0.406: PIC18F26K22.13 27.93,41.08 27.5,41.5 27.5,42 29.31,43.81 JP10.2 30.48,46.71 30.48,46.74 32.51,46.74 38.61,40.64 43.14,40.64 JP3.2
RC3
  Top 0.406: PIC18F26K22.14 29.16,42.16 31.8,44.8 | 31.8,44.8 31.84,44.84 JP10.1 31.8,45.23 31.8,44.8
RC4
  Top 0.406: PIC18F26K22.15 21.27,41.73 19.14,43.86 JP10.6
RC5
  Top 0.406: PIC18F26K22.16 23.07,41.08 23.5,41.5 23.5,42 21.69,43.81 JP10.5
RX1_FT230  (2 unrouted)
RX1_PIC  (2 unrouted)
  Top 0.406: JP9.2 19.19,41.31 20.73,39.77 PIC18F26K22.18
SDCARD_3.3  (via drill 0.7)
  Top 0.406: C15.1 28.19,9.39 v28.45,9.65 28.45,10.01 MCP1703.2
  Bottom 0.406: J3.VCC 30.98,8.14 29.46,9.65 v28.45,9.65
SPKR+
  Top 0.406: IC6.8 57.02,26.8 57.66,26.16 SPEAKER.1
SPKR-
  Top 0.406: IC6.5 53.72,22.99 52.83,23.88 52.83,28.04 R23.1 59.69,29.97 SPEAKER.2
TX1_FT230  (2 unrouted)
TX1_PIC  (2 unrouted)
  Top 0.406: PIC18F26K22.17 23.43,40.42 24.23,41.23 JP10.4
USBDM
  Top 0.406: IC2.9 23.22,8.02 22.8,7.6 17.22,7.6 R1.1
USBDP
  Top 0.406: IC2.8 23.22,2.22 22.6,1.6 14.6,1.6 13.6,2.6 13.4,2.8 11.42,4.78 11.22,4.78 R4.1
VBUS
  Top 0.406: X1.VBUS 10.89,14.95 11.85,15.92 | 11.85,15.92 5V.1 11.81,18.1 C1.1 | R2.2 15.19,12.58 11.85,15.92
VBUS_FUSE
  Top 0.406: F1.2 22.42,14.79 C12.1 | IC2.12 21.32,11.39 C12.1 | C12.1 23.22,13.29 MCP1703.3
VCC
  Top 0.406: 21.95,10.16 IC2.11 21.95,8.46 | 22.59,10.16 IC2.10 22.59,8.46 | PIC18F26K22.20 20.96,38.48 20.32,39.12
  pour Top (rank 4): 0,0 65.53,0 65.53,56.13 0,56.13

### Text on the board
tPlace: 40 | 1 | C4 | C5 | C6 | C1 | C2 | C3 | GND | RX1 | TX1 | GND | C0 | C7 | AMP | in | PGC PGD GND VCC MCLR | VCC | A6 | RC2 | A7 | B0 | GND | B1 | LPF | in | B2 | A4 | A5 | LPF | out | B3 | B4 | A2 | A3 | TX2 | RX2 | B7 | B6 | B5 | A1 | A0 | MCLR | R | G | B
bStop: TX | RX | ALT | PIC | GND | GND | GND